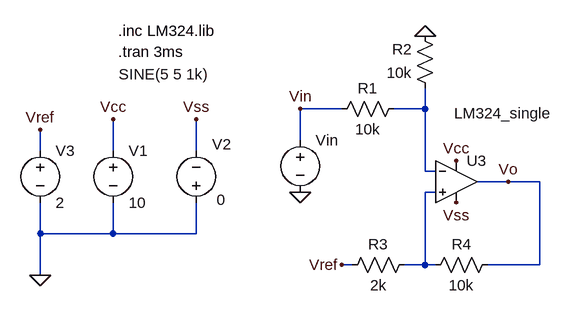
[diagram p0: schematic Circuito 4.asc]
Circuito 4.asc, the LTspice schematic file:
Version 4.1
SHEET 1 4928 940
WIRE 1856 368 1792 368
WIRE 1984 368 1984 336
WIRE 1984 368 1936 368
WIRE 1792 416 1792 368
WIRE 1392 432 1392 400
WIRE 1504 432 1504 384
WIRE 1632 432 1632 384
WIRE 1984 464 1984 368
WIRE 2000 464 1984 464
WIRE 2112 480 2064 480
WIRE 2160 480 2112 480
WIRE 2000 496 1984 496
WIRE 1392 560 1392 512
WIRE 1504 560 1504 512
WIRE 1504 560 1392 560
WIRE 1632 560 1632 512
WIRE 1632 560 1504 560
WIRE 1872 608 1856 608
WIRE 1984 608 1984 496
WIRE 1984 608 1952 608
WIRE 2000 608 1984 608
WIRE 2160 608 2160 480
WIRE 2160 608 2080 608
WIRE 1392 624 1392 560
FLAG 1392 624 0
FLAG 1504 384 Vcc
FLAG 1632 384 Vss
FLAG 2032 448 Vcc
FLAG 2032 512 Vss
FLAG 1792 496 0
FLAG 1984 256 0
FLAG 2112 480 Vo
FLAG 1856 608 Vref
FLAG 1392 400 Vref
FLAG 1792 368 Vin
SYMBOL voltage 1504 416 R0
WINDOW 123 0 0 Left 0
WINDOW 39 0 0 Left 0
SYMATTR InstName V1
SYMATTR Value 10
SYMBOL voltage 1632 528 R180
WINDOW 123 0 0 Left 0
WINDOW 39 0 0 Left 0
WINDOW 0 -54 106 Left 2
WINDOW 3 -45 20 Left 2
SYMATTR InstName V2
SYMATTR Value 0
SYMBOL OpAmps\\opamp2 2032 416 R0
WINDOW 3 -3 -41 Left 2
SYMATTR Value LM324_single
SYMATTR InstName U3
SYMBOL voltage 1792 400 R0
WINDOW 123 0 0 Left 0
WINDOW 39 0 0 Left 0
WINDOW 3 -279 -85 Left 2
SYMATTR InstName Vin
SYMATTR Value SINE(5 5 1k)
SYMBOL res 1952 352 R90
WINDOW 0 0 56 VBottom 2
WINDOW 3 32 56 VTop 2
SYMATTR InstName R1
SYMATTR Value 10k
SYMBOL res 2000 352 R180
WINDOW 0 36 76 Left 2
WINDOW 3 36 40 Left 2
SYMATTR InstName R2
SYMATTR Value 10k
SYMBOL res 1984 624 R270
WINDOW 0 32 56 VTop 2
WINDOW 3 0 56 VBottom 2
SYMATTR InstName R4
SYMATTR Value 10k
SYMBOL res 1968 592 R90
WINDOW 0 0 56 VBottom 2
WINDOW 3 32 56 VTop 2
SYMATTR InstName R3
SYMATTR Value 2k
SYMBOL voltage 1392 416 R0
WINDOW 123 0 0 Left 0
WINDOW 39 0 0 Left 0
SYMATTR InstName V3
SYMATTR Value 2
TEXT 1512 248 Left 2 !.inc LM324.lib
TEXT 1512 280 Left 2 !.tran 3ms

The netlist it stands for:
* Circuito 4.asc
V1 Vcc 0 10
V2 0 Vss 0
X§U3 N002 N001 Vcc Vss Vo LM324_single  ; pins In+ In- V+ V- OUT
Vin Vin 0 SINE(5 5 1k)
R1 N001 Vin 10k
R2 N001 0 10k
R4 N002 Vo 10k
R3 N002 Vref 2k
V3 Vref 0 2
.inc LM324.lib
.tran 3ms
.backanno
.end